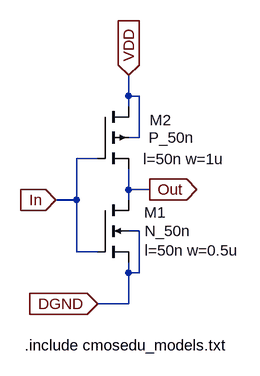
[diagram p0: schematic Inverter.asc]
Inverter.asc, the LTspice schematic file:
Version 4
SHEET 1 880 680
WIRE 176 16 176 -16
WIRE 192 16 176 16
WIRE 176 32 176 16
WIRE 192 80 192 16
WIRE 192 80 176 80
WIRE 128 112 96 112
WIRE 176 160 176 128
WIRE 208 160 176 160
WIRE 96 176 96 112
WIRE 96 176 64 176
WIRE 176 176 176 160
WIRE 192 224 176 224
WIRE 96 256 96 176
WIRE 128 256 96 256
WIRE 176 288 176 272
WIRE 192 288 192 224
WIRE 192 288 176 288
WIRE 176 336 176 288
WIRE 176 336 128 336
FLAG 176 -16 VDD
IOPIN 176 -16 In
FLAG 64 176 In
IOPIN 64 176 In
FLAG 208 160 Out
IOPIN 208 160 Out
FLAG 128 336 DGND
IOPIN 128 336 In
SYMBOL nmos4 128 176 R0
WINDOW 0 72 19 Left 0
WINDOW 3 73 48 Left 0
WINDOW 123 73 78 Left 0
SYMATTR InstName M1
SYMATTR Value N_50n
SYMATTR Value2 l=50n w=0.5u
SYMBOL pmos4 128 32 R0
WINDOW 0 80 21 Left 0
WINDOW 3 79 48 Left 0
WINDOW 123 70 81 Left 0
SYMATTR InstName M2
SYMATTR Value P_50n
SYMATTR Value2 l=50n w=1u
TEXT 16 400 Left 0 !.include cmosedu_models.txt

The netlist it stands for:
* Inverter.asc
M1 Out In DGND DGND N_50n l=50n w=0.5u
M2 VDD In Out VDD P_50n l=50n w=1u
.model NMOS NMOS
.model PMOS PMOS
.lib standard.mos
.include cmosedu_models.txt
.backanno
.end